# EAGLE design CORDI1-R01 (EAGLE 5.12)
INFO: 7 x 5 x 1.2mm, 12pF; MF: ST; MPN: STPS0540Z; OC_FARNELL: 1838511; REICHELT: SL 1X40G 2,54 (nur 1/2); RS: 250-274
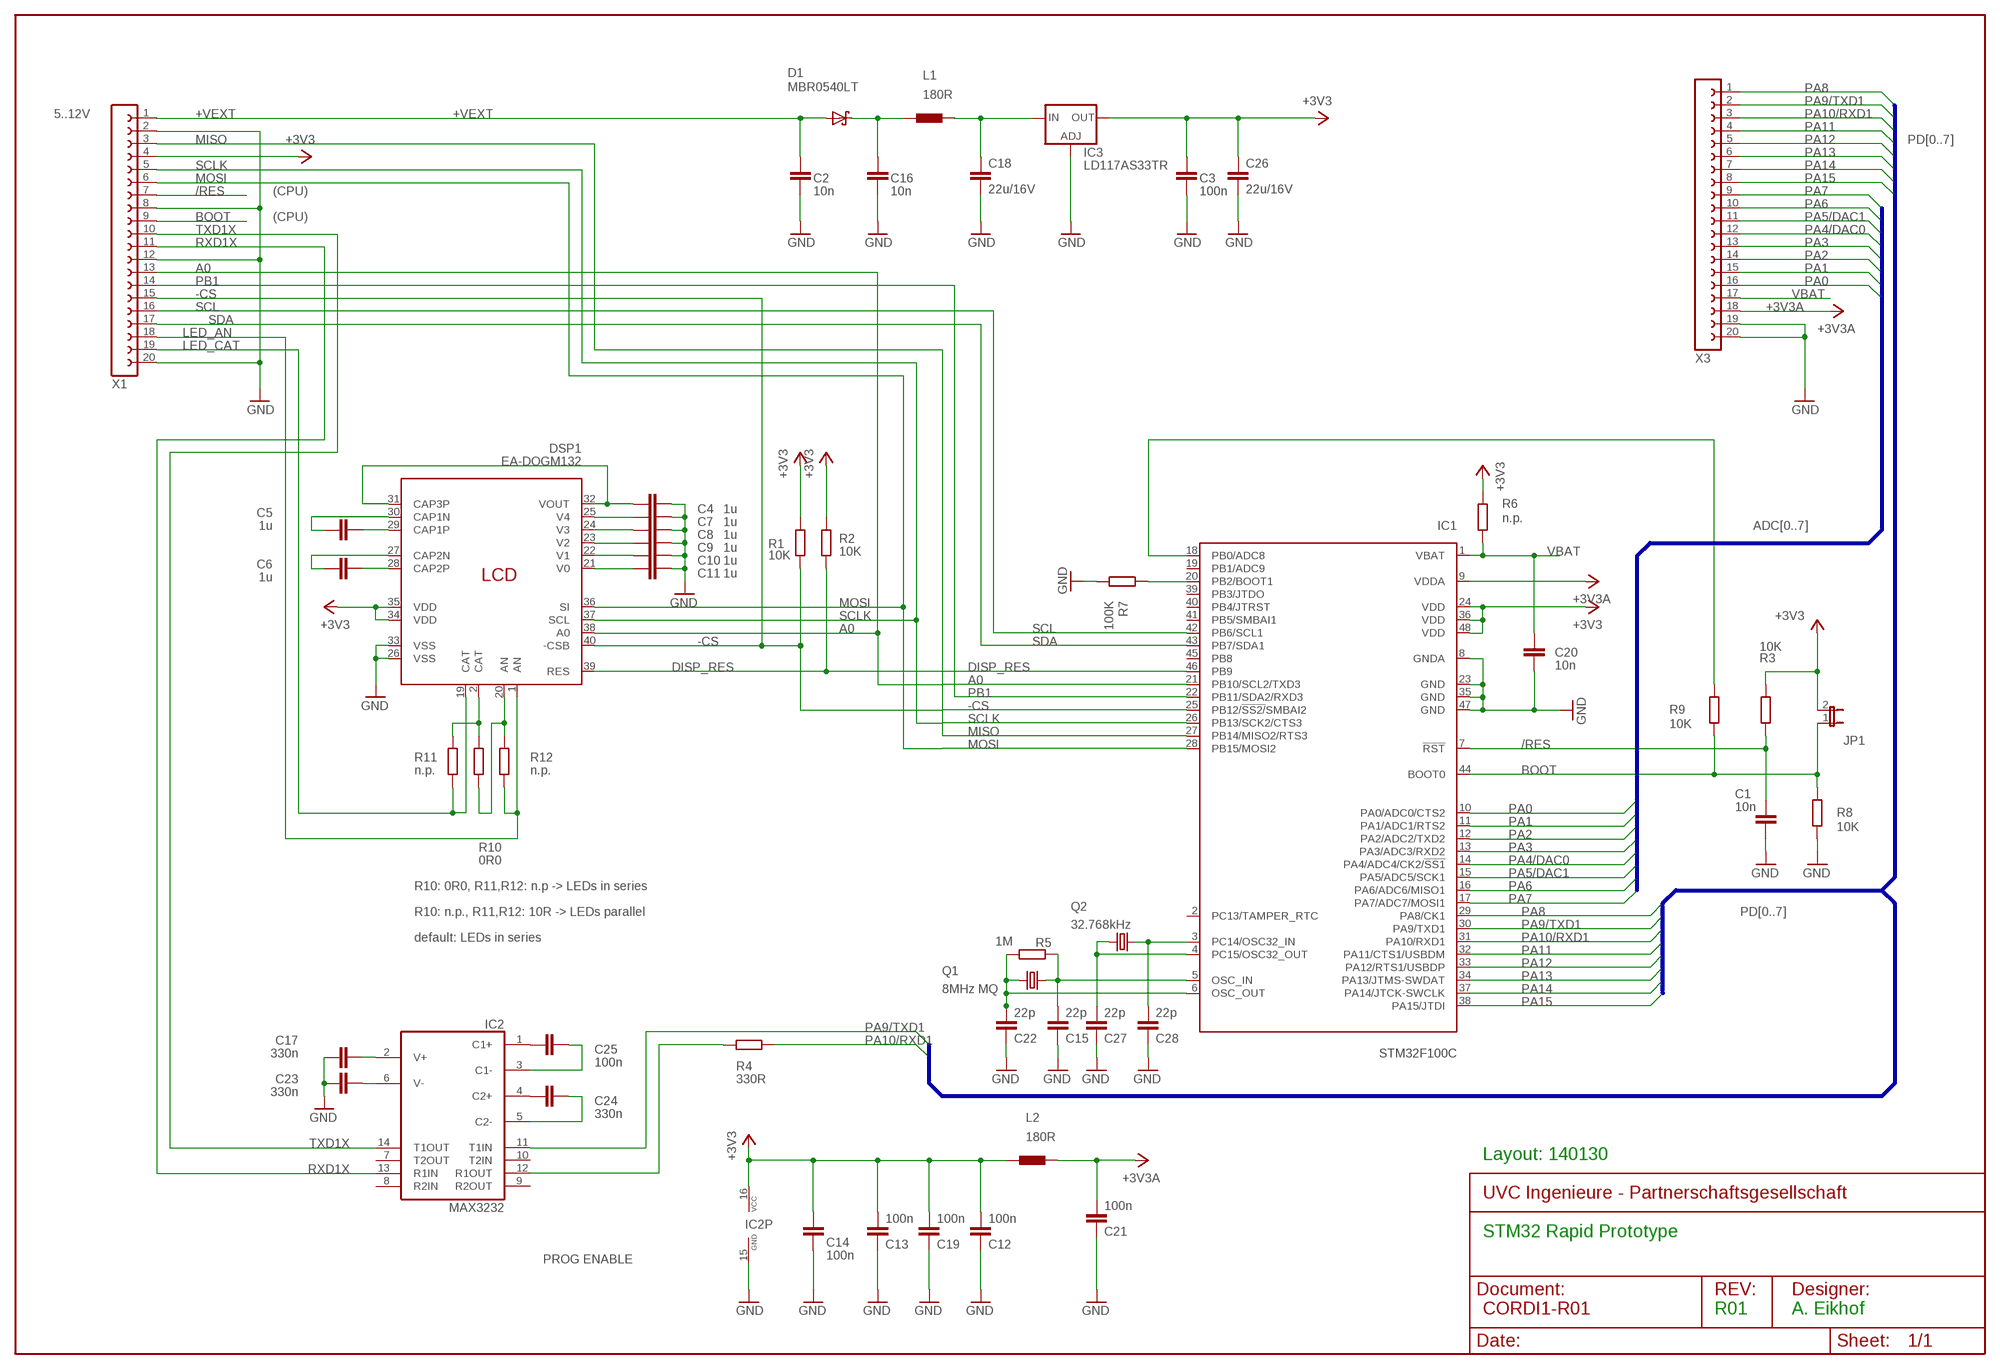
[diagram p0: schematic, sheet 1]

## Parts
C1  10n  C-EUC0603  [C0603]
C2  10n  C-EUC0603  [C0603]
C3  100n  C-EUC0603  [C0603]
C4  1u  C-EUC0603  [C0603]
C5  1u  C-EUC0603  [C0603]
C6  1u  C-EUC0603  [C0603]
C7  1u  C-EUC0603  [C0603]
C8  1u  C-EUC0603  [C0603]
C9  1u  C-EUC0603  [C0603]
C10  1u  C-EUC0603  [C0603]
C11  1u  C-EUC0603  [C0603]
C12  100n  C-EUC0603  [C0603]
C13  100n  C-EUC0603  [C0603]
C14  100n  C-EUC0603  [C0603]
C15  22p  C-EUC0603  [C0603]
C16  10n  C-EUC0603  [C0603]
C17  330n  C-EUC0603  [C0603]
C18  22u/16V  C-EUC1210  [C1210]
C19  100n  C-EUC0603  [C0603]
C20  10n  C-EUC0603  [C0603]
C21  100n  C-EUC0603  [C0603]
C22  22p  C-EUC0603  [C0603]
C23  330n  C-EUC0603  [C0603]
C24  330n  C-EUC0603  [C0603]
C25  100n  C-EUC0603  [C0603]
C26  22u/16V  C-EUC1210  [C1210]
C27  22p  C-EUC0603  [C0603]
C28  22p  C-EUC0603  [C0603]
D1  MBR0540LT  MBR0520LT  [SOD123]
DSP1  EA-DOGM132  DOGM132  [EADOGM08]
IC1  STM32F100C  [TQFP48]
IC2  MAX3232  MAX232CSE  [SO16]
IC3  LD117AS33TR  [SOT223]
JP1  JP1E  [JP1]
L1  180R  WE-CBF_0603  [0603]
L2  180R  WE-CBF_0603  [0603]
Q1  8MHz MQ  MQ  [MQ]
Q2  32.768kHz  FC-135  [FC-135]
R1  10K  R-EU_R0603  [R0603]
R2  10K  R-EU_R0603  [R0603]
R3  10K  R-EU_R0603  [R0603]
R4  330R  R-EU_R0603  [R0603]
R5  1M  R-EU_R0603  [R0603]
R6  n.p.  R-EU_R0603  [R0603]
R7  100K  R-EU_R0603  [R0603]
R8  10K  R-EU_R0603  [R0603]
R9  10K  R-EU_R0603  [R0603]
R10  0R0  R-EU_R0603  [R0603]
R11  n.p.  R-EU_R0603  [R0603]
R12  n.p.  R-EU_R0603  [R0603]
X1  FE20-1  [FE20]
X3  FE20-1  [FE20]

## Nets
+3V3 [SUPPLY3]: C3.1 C12.2 C13.2 C14.1 C19.2 C26.1 DSP1.34(VDD) DSP1.35(VDD) IC1.24(VDD) IC1.36(VDD) IC1.48(VDD) IC2.16(VCC) IC3.4(OUT) JP1.2 L2.1 R1.2 R2.2 R3.2 R6.1 X1.4
+3V3A: C21.2 IC1.9(VDDA) L2.2 X3.18
+VEXT: C2.1 D1.A X1.1
-CS: DSP1.40(-CSB) IC1.25(PB12/!SS2/!SMBAI2) R1.1 X1.15
/RES: C1.2 IC1.7(!RST) R3.1 X1.7
A0: DSP1.38(A0) IC1.21(PB10/SCL2/TXD3) X1.13
BOOT: IC1.44(BOOT0) JP1.1 R8.2 R9.1 X1.9
DISP_RES: DSP1.39(RES) IC1.46(PB9) R2.1
GND: C1.1 C2.2 C3.2 C4.1 C7.1 C8.1 C9.1 C10.1 C11.1 C12.1 C13.1 C14.2 C15.1 C16.2 C17.2 C18.2 C19.1 C20.1 C21.1 C22.1 C23.2 C26.2 C27.1 C28.1 DSP1.26(VSS) DSP1.33(VSS) IC1.8(GNDA) IC1.23(GND) IC1.35(GND) IC1.47(GND) IC2.15(GND) IC3.1(ADJ) R7.1 R8.1 X1.2 X1.8 X1.12 X1.20 X3.19 X3.20
LED_AN: DSP1.1(AN) R12.1 X1.18
LED_AN2: DSP1.20(AN) R10.1 R12.2
LED_CAT: DSP1.19(CAT) R11.1 X1.19
LED_CAT1: DSP1.2(CAT) R10.2 R11.2
MISO: IC1.27(PB14/MISO2/RTS3) X1.3
MOSI: DSP1.36(SI) IC1.28(PB15/MOSI2) X1.6
N$1 [SUPPLY12]: C18.1 IC3.3(IN) L1.2
N$3: IC2.12(R1OUT) R4.2
N$6: C25.2 IC2.1(C1+)
N$7: C17.1 IC2.2(V+)
N$20: C25.1 IC2.3(C1-)
N$28: IC1.18(PB0/ADC8) R9.2
N$30: C16.1 D1.C L1.1
N$31: C4.2 DSP1.31(CAP3P) DSP1.32(VOUT)
N$57: C7.2 DSP1.25(V4)
N$58: C24.1 IC2.5(C2-)
N$62: C24.2 IC2.4(C2+)
N$64: C23.1 IC2.6(V-)
N$67: C8.2 DSP1.24(V3)
N$69: C9.2 DSP1.23(V2)
N$70: C10.2 DSP1.22(V1)
N$71: C11.2 DSP1.21(V0)
N$72: C5.2 DSP1.29(CAP1P)
N$73: C6.2 DSP1.28(CAP2P)
N$74: C6.1 DSP1.27(CAP2N)
N$75: C5.1 DSP1.30(CAP1N)
N$182: C15.2 IC1.5(OSC_IN) Q1.3 R5.2
N$184: C22.2 IC1.6(OSC_OUT) Q1.1 R5.1
N$240: IC1.20(PB2/BOOT1) R7.2
OSC32_IN: C28.2 IC1.3(PC14/OSC32_IN) Q2.2
OSC32_OUT: C27.2 IC1.4(PC15/OSC32_OUT) Q2.1
PA0: IC1.10(PA0/ADC0/CTS2) X3.16
PA1: IC1.11(PA1/ADC1/RTS2) X3.15
PA2: IC1.12(PA2/ADC2/TXD2) X3.14
PA3: IC1.13(PA3/ADC3/RXD2) X3.13
PA4/DAC0: IC1.14(PA4/ADC4/CK2/!SS1) X3.12
PA5/DAC1: IC1.15(PA5/ADC5/SCK1) X3.11
PA6: IC1.16(PA6/ADC6/MISO1) X3.10
PA7: IC1.17(PA7/ADC7/MOSI1) X3.9
PA8: IC1.29(PA8/CK1) X3.1
PA9/TXD1: IC1.30(PA9/TXD1) IC2.11(T1IN) X3.2
PA10/RXD1: IC1.31(PA10/RXD1) R4.1 X3.3
PA11: IC1.32(PA11/CTS1/USBDM) X3.4
PA12: IC1.33(PA12/RTS1/USBDP) X3.5
PA13: IC1.34(PA13/JTMS-SWDAT) X3.6
PA14: IC1.37(PA14/JTCK-SWCLK) X3.7
PA15: IC1.38(PA15/JTDI) X3.8
PB1: IC1.22(PB11/SDA2/RXD3) X1.14
RXD1X: IC2.13(R1IN) X1.11
SCL: IC1.42(PB6/SCL1) X1.16
SCLK: DSP1.37(SCL) IC1.26(PB13/SCK2/CTS3) X1.5
SDA: IC1.43(PB7/SDA1) X1.17
TXD1X: IC2.14(T1OUT) X1.10
VBAT: C20.2 IC1.1(VBAT) R6.2 X3.17
Unconnected: IC1.2(PC13/TAMPER_RTC) IC1.19(PB1/ADC9) IC1.39(PB3/JTDO) IC1.40(PB4/JTRST) IC1.41(PB5/SMBAI1) IC1.45(PB8) IC2.7(T2OUT) IC2.8(R2IN) IC2.9(R2OUT) IC2.10(T2IN)

## Buses
PD[0..7]
ADC[0..7]

## Notes on the sheet
- 5..12V
- (CPU)
- (CPU)
- R10: 0R0, R11,R12: n.p -> LEDs in series
- R10: n.p., R11,R12: 10R -> LEDs parallel
- default: LEDs in series
- Layout: 140130
- STM32 Rapid Prototype
- PROG ENABLE
- R01 | A. Eikhof

## Power pins joined to a net without a drawn wire
GND: Q1.2(GND) Q1.4(GND)

## Library data of the parts
C1-C28 = _rcl:C-EU: CAPACITOR, European symbol
D1 = _diode:MBR0520LT: SCHOTTKY BARRIER RECTIFIER Source: http://onsemi.com .. MBR0520LT1-D.pdf
DSP1 = LCDISPLA:DOGM132
IC1 = _stm32:STM32F100C
IC2 = _maxim:MAX232: RS232 TRANSEIVER
IC3 = v-reg:LD117A?*: Low drop fixed and adjustable positive voltage regulators 1 A Source: http://www.st.com/stonline/products/literature/ds/7194/ld1117axx.pdf
JP1 = _jumper:JP1E: JUMPER
L1 L2 = _wuerth-elektronik:WE-CBF: SMD EMI Suppression Ferrite Beads - excellent anti-EMI properties - low DCR - impedances till 3000 ohms - rated current up to 6 A
Q1 = _crystal:MQ: MQ ( 7.0 * 5.0 * 1.2 mm ) Series, Euroquartz, Mercury
Q2 = _crystal:FC-135: Epson Toyocom, kHz Range crystal unit, low profile smd 1.5 x 3.2mm
R1-R12 = _rcl:R-EU_: RESISTOR, European symbol
X1 X3 = _con-lsta:FE20-1: FEMALE HEADER

## Net classes
1 PWR: width 0.254 mm, drill 0.5 mm, clearance 0.152 mm
2 SUPPLY3: width 0.254 mm, drill 0.406 mm
3 SUPPLY12: width 0.61 mm

## Board
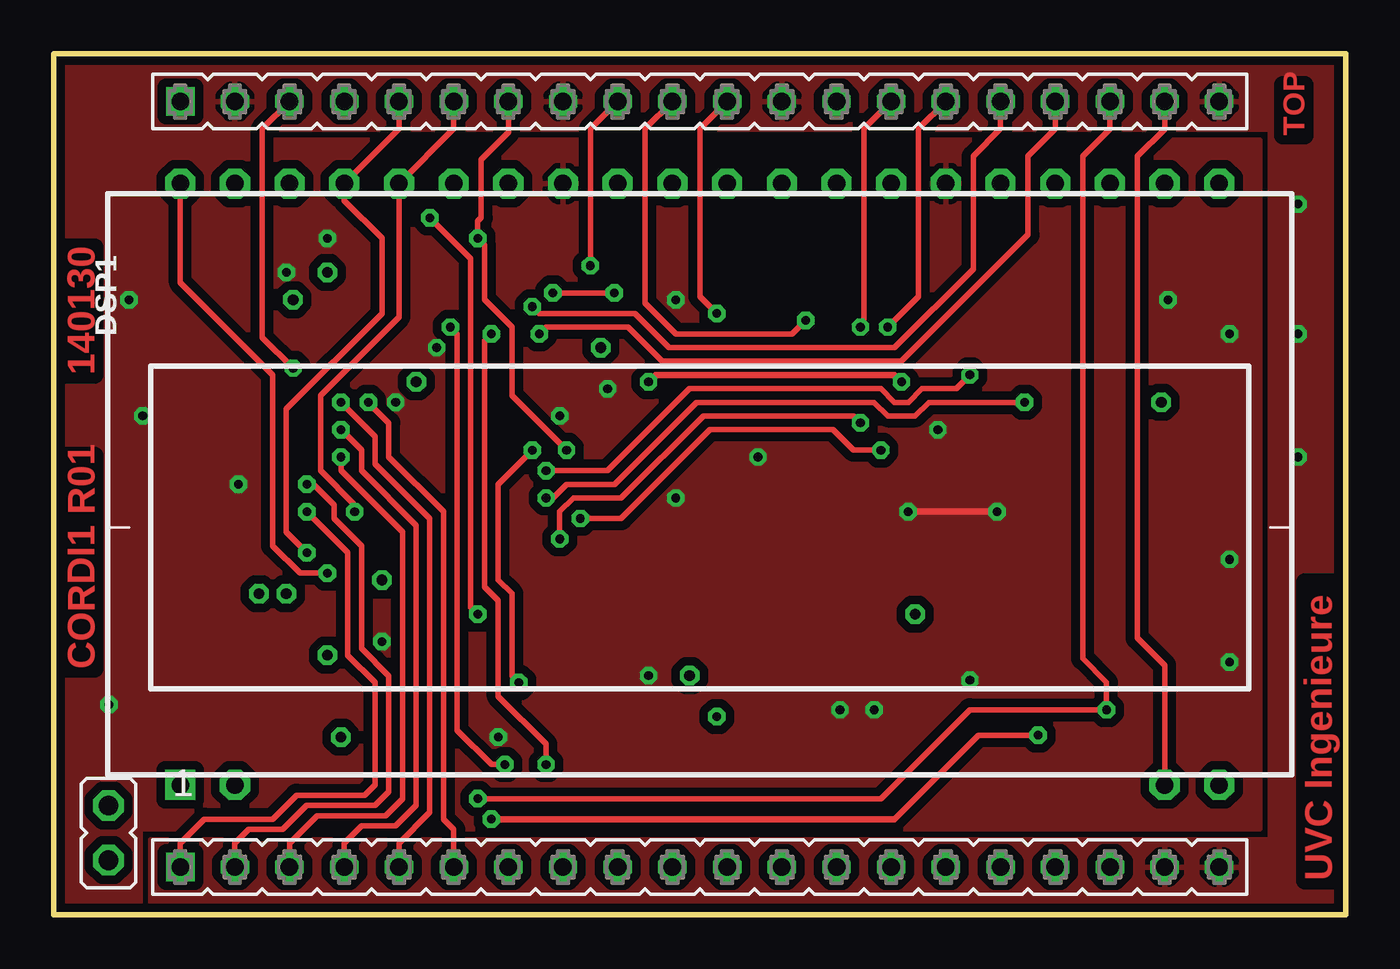
[diagram p1: board, top side]
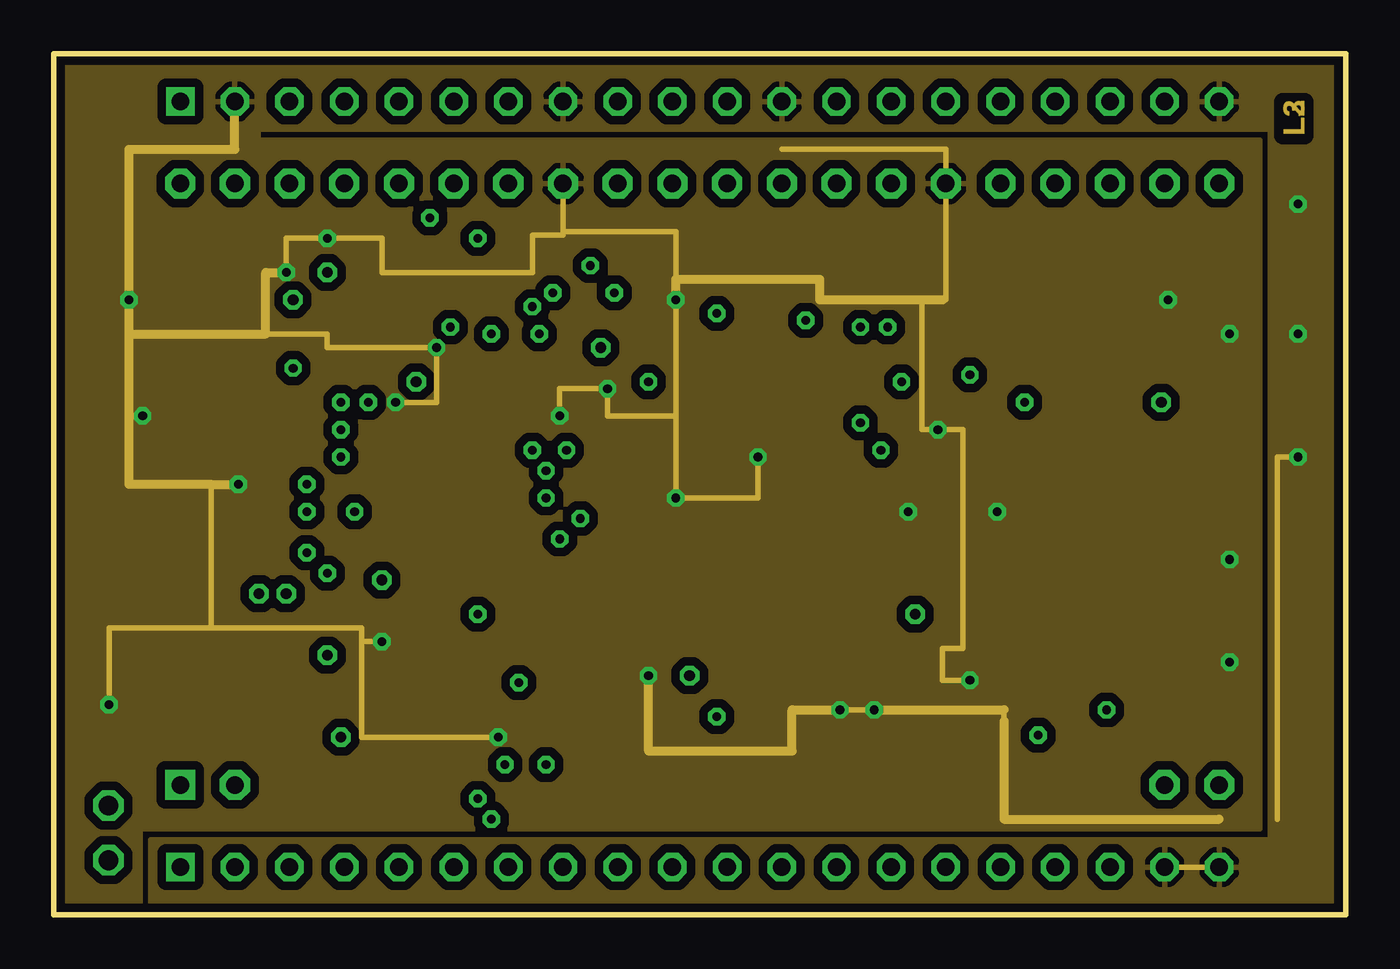
[diagram p2: board, inner layer Route2]
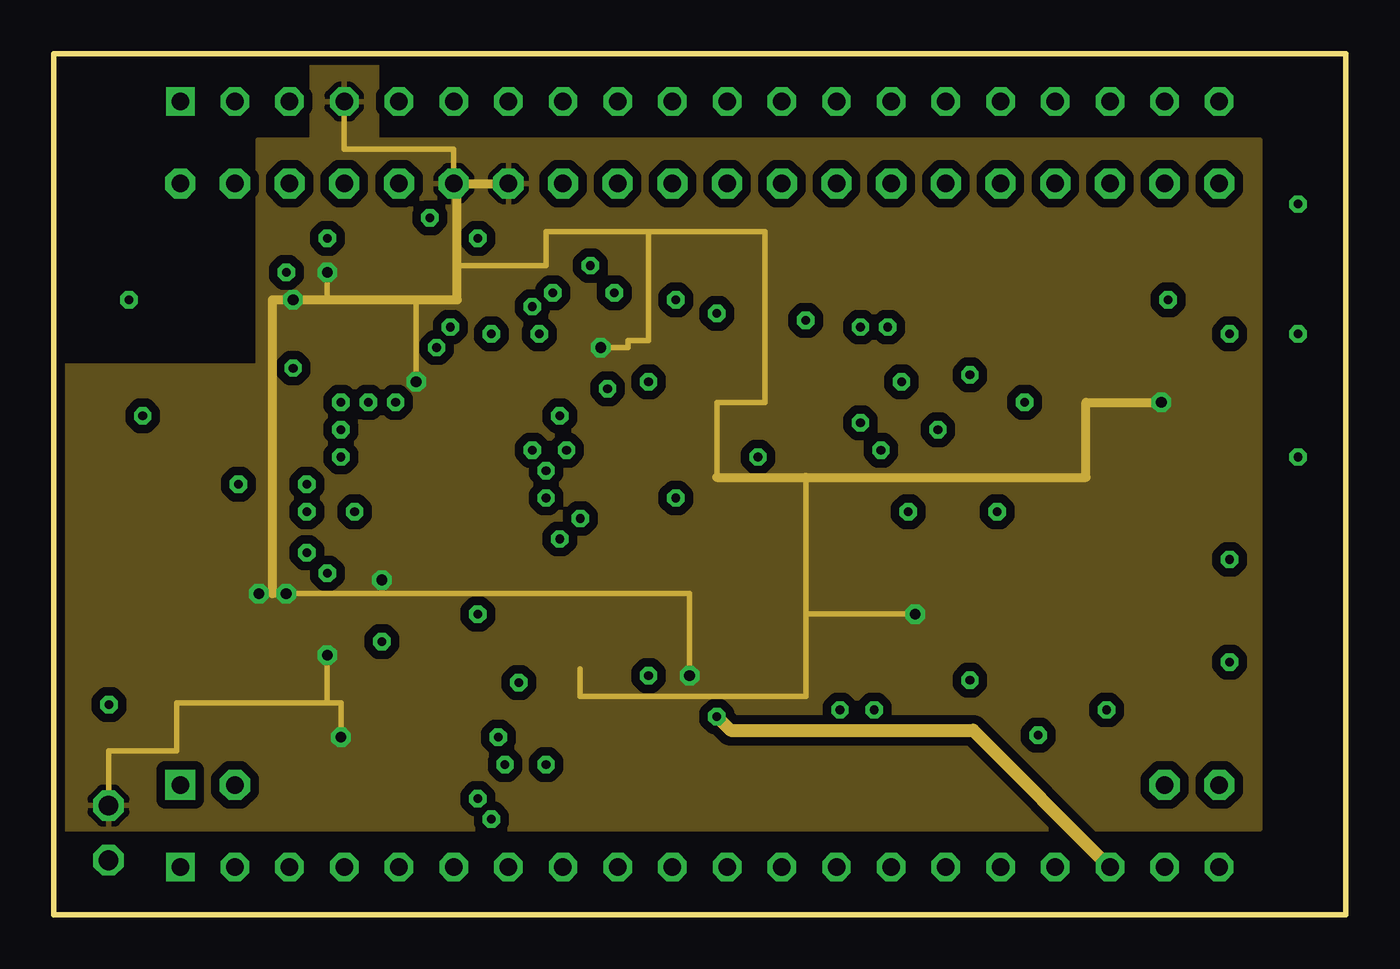
[diagram p3: board, inner layer Route3]
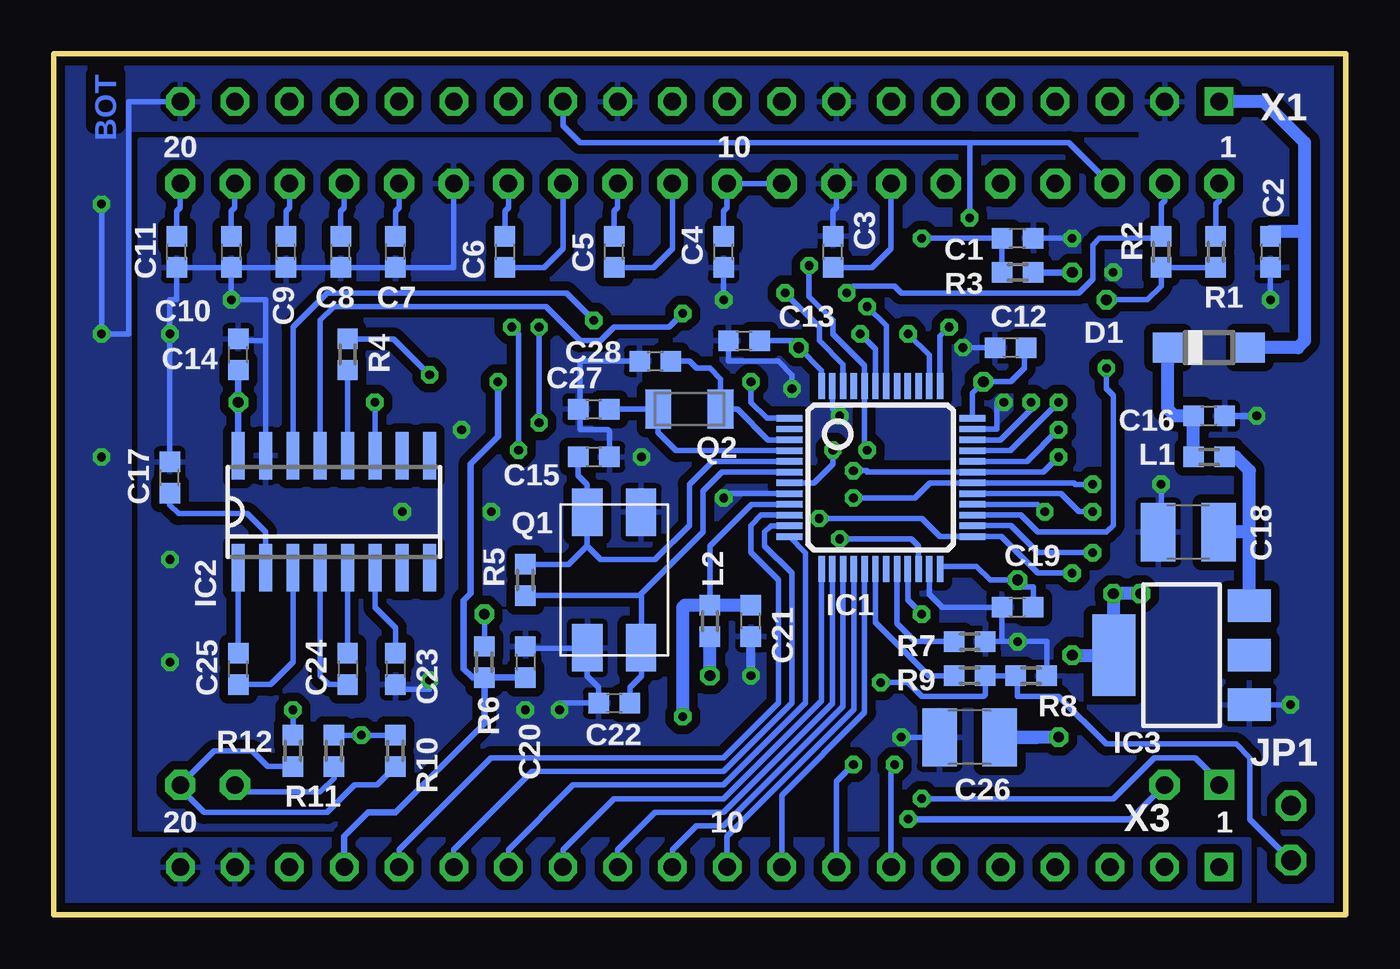
[diagram p4: board, bottom side, seen from below]

Size 60 x 40 mm. Coordinates in mm from the lower left corner, seen from the top.
Outline: 0,0 60,0 60,40 0,40 0,0
Copper layers (1*2*3*16): Top 0.035mm / dielectric 0.36mm / Route2 0.035mm / dielectric 0.71mm / Route3 0.035mm / dielectric 0.36mm / Bottom 0.035mm
Design rules "default *": minimum track width 7mil, minimum drill 15mil, track to track 6mil, track to pad 6mil, pad to pad 6mil, via to via 6mil, smd to smd 6mil, copper to edge 16mil, drill to drill 8mil, minimum pad ring 10mil, minimum via ring 8mil, stop-mask expansion 4mil, vias tented up to drill 24mil, thermal gap 10mil

### Footprints (pad centres in the part's own frame; a part is rotated, then mirrored left to right if it is on the bottom)
C0603 = smd 0.95 x 0.95: 1 -0.725,0; 2 0.725,0
C1210 = smd 1.6 x 2.7: 1 -1.4,0; 2 1.4,0
SOD123 = smd 1.4 x 1.4: A 1.9,0; C -1.9,0
EADOGM08 = drill 0.813 pad 1.397 square: 1 -24.13,-13.97 | drill 0.813 pad 1.397 octagon: 2 -21.59,-13.97; 19 21.59,-13.97; 20 24.13,-13.97; 21 24.13,13.97; 22 21.59,13.97; 23 19.05,13.97; 24 16.51,13.97; 25 13.97,13.97; 26 11.43,13.97; 27 8.89,13.97; 28 6.35,13.97; 29 3.81,13.97; 30 1.27,13.97; 31 -1.27,13.97; 32 -3.81,13.97; 33 -6.35,13.97; 34 -8.89,13.97; 35 -11.43,13.97; 36 -13.97,13.97; 37 -16.51,13.97; 38 -19.05,13.97; 39 -21.59,13.97; 40 -24.13,13.97
TQFP48 = smd 0.3 x 1.2: 1 -2.75,-4.25; 2 -2.25,-4.25; 3 -1.75,-4.25; 4 -1.25,-4.25; 5 -0.75,-4.25; 6 -0.25,-4.25; 7 0.25,-4.25; 8 0.75,-4.25; 9 1.25,-4.25; 10 1.75,-4.25; 11 2.25,-4.25; 12 2.75,-4.25; 25 2.75,4.25; 26 2.25,4.25; 27 1.75,4.25; 28 1.25,4.25; 29 0.75,4.25; 30 0.25,4.25; 31 -0.25,4.25; 32 -0.75,4.25; 33 -1.25,4.25; 34 -1.75,4.25; 35 -2.25,4.25; 36 -2.75,4.25 | smd 1.2 x 0.3: 13 4.25,-2.75; 14 4.25,-2.25; 15 4.25,-1.75; 16 4.25,-1.25; 17 4.25,-0.75; 18 4.25,-0.25; 19 4.25,0.25; 20 4.25,0.75; 21 4.25,1.25; 22 4.25,1.75; 23 4.25,2.25; 24 4.25,2.75; 37 -4.25,2.75; 38 -4.25,2.25; 39 -4.25,1.75; 40 -4.25,1.25; 41 -4.25,0.75; 42 -4.25,0.25; 43 -4.25,-0.25; 44 -4.25,-0.75; 45 -4.25,-1.25; 46 -4.25,-1.75; 47 -4.25,-2.25; 48 -4.25,-2.75
SO16 = smd 0.6 x 2.2: 1 -4.445,-2.6; 2 -3.175,-2.6; 3 -1.905,-2.6; 4 -0.635,-2.6; 5 0.635,-2.6; 6 1.905,-2.6; 7 3.175,-2.6; 8 4.445,-2.6; 9 4.445,2.6; 10 3.175,2.6; 11 1.905,2.6; 12 0.635,2.6; 13 -0.635,2.6; 14 -1.905,2.6; 15 -3.175,2.6; 16 -4.445,2.6
SOT223 = smd 1.5 x 2: 1 -2.3,-3.15; 2 0,-3.15; 3 2.3,-3.15 | smd 3.8 x 2: 4 0,3.15
JP1 = drill 0.914 octagon: 1 0,-1.27; 2 0,1.27
0603 = smd 0.95 x 0.95: 1 -0.725,0; 2 0.725,0
MQ = smd 2.2 x 1.4: 1 -3.15,-1.25; 2 3.15,-1.25; 3 3.15,1.25; 4 -3.15,1.25
FC-135 = smd 1.2 x 1.8: 1 -1.45,0; 2 1.45,0
R0603 = smd 0.95 x 0.95: 1 -0.725,0; 2 0.725,0
FE20 = drill 0.813 square: 1 -24.13,0 | drill 0.813 octagon: 2 -21.59,0; 3 -19.05,0; 4 -16.51,0; 5 -13.97,0; 6 -11.43,0; 7 -8.89,0; 8 -6.35,0; 9 -3.81,0; 10 -1.27,0; 11 1.27,0; 12 3.81,0; 13 6.35,0; 14 8.89,0; 15 11.43,0; 16 13.97,0; 17 16.51,0; 18 19.05,0; 19 21.59,0; 20 24.13,0

### Placement (x,y rotation side)
C1  15.24,31.43 180 bottom
C2  3.49,30.8 270 bottom
C3  23.81,30.8 90 bottom
C4  28.89,30.8 90 bottom
C5  33.97,30.8 90 bottom
C6  39.05,30.8 270 bottom
C7  44.13,30.8 90 bottom
C8  46.67,30.8 90 bottom
C9  49.21,30.8 90 bottom
C10  51.75,30.8 90 bottom
C11  54.29,30.8 90 bottom
C12  15.56,26.35 0 bottom
C13  27.94,26.67 0 bottom
C14  51.44,26.04 90 bottom
C15  34.92,21.27 180 bottom
C16  6.35,23.18 0 bottom
C17  54.61,20.32 90 bottom
C18  7.3,17.78 180 bottom
C19  15.24,14.29 0 bottom
C20  38.1,11.75 270 bottom
C21  27.62,13.65 90 bottom
C22  33.97,9.84 0 bottom
C23  44.13,11.43 270 bottom
C24  46.35,11.43 270 bottom
C25  51.44,11.43 90 bottom
C26  17.46,8.26 180 bottom
C27  34.92,23.5 0 bottom
C28  32.07,25.72 0 bottom
D1  6.35,26.35 0 bottom
DSP1  30,20 0 top
IC1  21.59,20.32 270 bottom
IC2  46.99,18.73 0 bottom
IC3  7.62,12.06 90 bottom
JP1  2.54,3.81 0 top
L1  6.35,21.27 0 bottom
L2  29.53,13.65 90 bottom
Q1  33.97,15.56 90 bottom
Q2  30.48,23.5 0 bottom
R1  6.03,30.8 270 bottom
R2  8.57,30.8 270 bottom
R3  15.24,29.84 0 bottom
R4  46.35,26.04 270 bottom
R5  38.1,15.56 90 bottom
R6  40.01,11.75 270 bottom
R7  17.46,12.7 180 bottom
R8  14.61,11.11 180 bottom
R9  17.46,11.11 180 bottom
R10  44.13,7.62 90 bottom
R11  46.99,7.62 90 bottom
R12  48.9,7.62 270 bottom
X1  30,37.78 0 top
X3  30,2.22 0 top

### Tracks (layer width: path | path; a pad name or v marks a point on that pad's centre or on a via)
+3V3  (via drill 0.5)
  Route3 0.254: X1.4 13.49,35.56 18.57,35.56 DSP1.35 | 18.73,30.16 22.86,30.16 22.86,31.75 27.62,31.75 | 27.62,31.75 33.02,31.75 33.02,23.81 30.8,23.81 30.8,20.32 | 24.45,11.43 24.45,10.16 34.92,10.16 34.92,13.97 | 34.92,20.32 34.92,13.97 | v29.53,11.11 29.53,14.92 15.24,14.92 | 27.62,31.75 27.62,26.67 26.67,26.67 26.67,26.35 v25.4,26.35 | 11.11,14.92 15.24,14.92 | 15.24,14.92 v15.24,15.56 | 34.92,13.97 v40.01,13.97 | 16.83,28.57 v16.83,24.77 | JP1.2 2.54,7.62 5.71,7.62 5.71,9.84 12.7,9.84 | 12.7,9.84 13.34,9.84 v13.34,8.26 | 12.7,9.84 v12.7,12.06 | 12.7,28.57 v12.7,29.84
  Route3 0.406: 18.73,33.97 DSP1.34 | 30.8,20.32 34.92,20.32 47.94,20.32 47.94,23.81 v51.44,23.81 | 18.73,33.97 18.73,30.16 18.73,28.57 16.83,28.57 12.7,28.57 v11.11,28.57 10.16,28.57 10.16,14.92 v10.79,14.92 11.11,14.92 | 18.73,33.97 DSP1.35
  Bottom 0.254: R1.2 R2.2 8.57,29.21 9.21,28.57 v11.11,28.57 | C13.2 25.72,26.67 v25.4,26.35 24.34,25.29 IC1.48 | IC1.24 18.84,16.19 17.14,16.19 16.51,15.56 v15.24,15.56 15.24,15.24 14.52,15.24 C19.2 | v40.01,13.97 R6.1 | IC1.36 17.34,24.25 v16.83,24.77 15.56,24.77 14.92,25.4 14.92,26.35 C12.2 | C3.1 22,30.07 21.11,30.96 DSP1.34
  Bottom 0.305: IC2.16 v51.44,23.81 C14.1 | v12.7,29.84 R3.2
  Bottom 0.61: 10.79,12.38 v10.79,14.92 v9.53,14.92 | v13.34,8.26 C26.1 14.29,8.26 | v29.53,11.11 L2.1 | v12.7,12.06 IC3.4
  pour Route3 (isolate 0.406): 0.5,4 0.5,25.5 9.5,25.5 9.5,36 12,36 12,39.5 15,39.5 15,36 56,36 56,4
+3V3A  (via drill 0.4)
  Route3 0.61: X3.18 42.7,8.57 31.43,8.57 v30.8,9.21
  Bottom 0.254: IC1.9 27.6,19.07 29.53,17.14 L2.2
  Bottom 0.406: 30.71,14.38 30.8,14.29
  Bottom 0.61: C21.2 L2.2 30.71,14.38 | 30.8,14.29 v30.8,9.21
+VEXT
  Bottom 0.254: 3.49,31.75 C2.1
  Bottom 0.61: X1.1 3.81,37.78 1.91,35.88 1.91,31.75 | 1.91,31.75 3.49,31.75 | 1.91,31.75 1.91,26.67 2.22,26.35 D1.A
-CS  (via drill 0.4)
  Top 0.254: v24.45,18.41 26.35,18.41 30.48,22.54 36.2,22.54 37.15,21.59 v38.42,21.59 | X1.15 40.16,36.52 40.16,28.73 v38.73,27.3 | v12.7,15.88 11.43,15.88 10.16,17.14 10.16,25.08 5.87,29.37 DSP1.40
  Bottom 0.254: DSP1.40 5.87,33.18 6.03,33.02 R1.1 | v24.45,18.41 19.68,18.41 18.84,17.57 IC1.25 15.98,17.57 14.29,15.88 v12.7,15.88 | v38.42,21.59 38.42,26.99 v38.73,27.3
/RES  (via drill 0.4)
  Top 0.254: X1.7 21.11,36.35 19.84,35.08 19.84,32.38 19.68,32.23 v19.68,31.43 20,31.11 20,28.57 21.27,27.3 21.27,24.13 v23.81,21.59
  Bottom 0.254: IC1.7 24.7,20.07 23.81,20.95 v23.81,21.59 | v19.68,31.43 C1.2 R3.1
A0  (via drill 0.4)
  Top 0.254: v19.68,13.97 19.37,14.29 19.37,30.48 v17.46,32.38
  Bottom 0.254: 17.46,35.88 12.86,35.88 DSP1.38 | 17.46,35.88 35.56,35.88 36.35,36.67 X1.13 | IC1.21 20.34,14.62 v19.68,13.97 | v17.46,32.38 17.46,35.88
BOOT  (via drill 0.4)
  Top 0.254: v24.92,30.16 24.92,36.52 X1.9 | v22.23,21.59 20.64,20 20.64,15.56 21.27,14.92 21.27,11.11 v21.59,10.79
  Bottom 0.254: v24.92,30.16 24.92,28.73 23.81,27.62 23.81,26.99 22.34,25.52 IC1.44 22.34,21.7 v22.23,21.59 | v21.59,10.79 20.32,10.79 19.68,10.16 16.83,10.16 16.74,10.25 R9.1 R8.2 15.24,11.02 15.24,10.16 13.34,10.16 11.11,7.94 5.08,7.94 4.45,7.3 4.45,4.45 JP1.1
DISP_RES  (via drill 0.4)
  Top 0.254: v23.18,28.89 v26.04,28.89
  Bottom 0.254: DSP1.39 8.41,33.18 8.57,33.02 R2.1 8.66,31.43 11.43,31.43 11.75,31.11 11.75,29.53 12.38,28.89 20.64,28.89 20.95,29.21 22.86,29.21 v23.18,28.89 | IC1.46 23.34,25.56 24.45,26.67 24.45,27.3 v26.04,28.89
GND  (via drill 0.4)
  Top 0.305: v39.69,18.73 v43.81,18.73
  Route2 0.254: 33.81,35.56 41.43,35.56 DSP1.26 41.43,28.57 41.27,28.57 40.32,28.57 40.32,22.54 v41.06,22.54 42.23,22.54 42.23,12.38 41.27,12.38 41.27,10.9 v42.55,10.9 | 14.29,12.7 14.29,8.26 v20.64,8.26 | 14.29,12.7 14.29,13.34 7.3,13.34 | 7.3,13.34 7.3,20 | v10.79,29.84 10.79,31.43 v12.7,31.43 15.24,31.43 15.24,29.84 22.23,29.84 22.23,31.59 23.65,31.59 23.65,31.75 | 23.65,31.75 DSP1.33 | 23.65,31.75 28.89,31.75 v28.89,28.57 28.89,23.18 | 36.2,9.53 v36.51,9.53 v38.1,9.53 | 44.13,9.53 44.13,8.99 | 28.89,23.18 v28.89,19.37 32.7,19.37 v32.7,21.27 | v23.5,23.18 23.5,24.45 v25.72,24.45 25.72,23.18 28.89,23.18 | 14.29,12.7 v15.24,12.7 | v15.88,23.81 17.78,23.81 v17.78,26.35 12.7,26.35 12.7,26.99 9.84,26.99 | X3.19 X3.20 | 56.83,4.45 56.83,21.27 v57.78,21.27 | 7.3,13.34 2.56,13.34 v2.56,9.77
  Route2 0.305: 3.49,23.18 v4.13,23.18
  Route2 0.406: v38.1,9.53 44.13,9.53 | 54.13,4.45 44.13,4.45 44.13,8.99 | X1.2 8.41,35.56 3.49,35.56 v3.49,28.57 3.49,26.99 | 3.49,26.99 3.49,23.18 3.49,20 7.3,20 v8.57,20 | v10.79,29.84 9.84,29.84 9.84,26.99 3.49,26.99 | v28.89,28.57 28.89,29.53 35.56,29.53 35.56,28.57 41.27,28.57 | 36.2,9.53 34.29,9.53 34.29,7.62 27.62,7.62 v27.62,11.11
  Bottom 0.254: C10.1 C9.1 C8.1 C7.1 41.43,30.07 DSP1.26 | C10.1 C11.1 54.29,28.57 54.61,28.57 C17.2 | 50.16,26.67 51.44,26.67 C14.2 | C10.1 v51.75,28.57 50.16,28.57 50.16,26.67 | 50.16,26.67 IC2.15 | DSP1.33 23.65,32.87 23.81,32.7 C3.2 | v3.49,28.57 C2.2 | X1.20 56.52,37.78 56.52,26.99 v57.78,26.99 v57.78,33.02 | v28.89,28.57 C4.1 | C23.2 44.13,10.48 42.55,10.48 v42.55,10.9 | v20.64,8.26 C26.2 | IC3.1 v2.56,9.77 | Q1.2 32.7,18.73 | 35.24,12.39 35.24,11.11 34.7,10.57 C22.1 36.51,9.84 v36.51,9.53 | 35.24,12.39 Q1.4 | IC1.47 23.84,23.52 v23.5,23.18 | IC1.23 19.34,14.89 18.73,14.29 C19.1 15.96,12.7 | 15.96,12.7 v15.24,12.7 13.88,12.7 R8.1 | 15.96,12.7 R7.1 | v25.72,24.45 25.72,25.08 26.35,25.72 28.66,25.72 C13.1 | 35.24,12.39 38.1,12.39 C20.1 | v17.78,26.35 C12.1 | v15.88,23.81 16.19,23.81 16.19,22.57 IC1.35 | v12.7,31.43 C1.1 | C18.2 8.57,17.78 v8.57,20 | IC1.8 28.89,19.57 v28.89,19.37 | C28.1 35.56,25.72 35.56,23.59 C27.1 35.56,23.41 35.56,22.54 34.29,22.54 34.2,22.45 C15.1
  Bottom 0.305: v4.13,23.18 C16.2
  Bottom 0.406: v27.62,11.11 C21.1
  other vias: 54.61,26.99 54.61,16.51 54.61,11.75
  pour Bottom (isolate 0.406): 0.5,0.5 0.5,39.5 59.5,39.5 59.5,0.5 4.5,0.5 4.5,3.5 56.5,3.5 56.5,36.5 9.5,36.5 9.5,36 56,36 56,4 4,4 4,0.5
  pour Top (isolate 0.406): 0.5,0.5 0.5,39.5 59.5,39.5 59.5,0.5 4.5,0.5 4.5,3.5 56.5,3.5 56.5,36.5 9.5,36.5 9.5,36 56,36 56,4 4,4 4,0.5
  pour Route2 (isolate 0.406): 0.5,0.5 0.5,39.5 59.5,39.5 59.5,0.5 4.5,0.5 4.5,3.5 56.5,3.5 56.5,36.5 9.5,36.5 9.5,36 56,36 56,4 4,4 4,0.5
LED_AN  (via drill 0.4)
  Top 0.254: X1.18 49.05,36.51 47.78,35.24 47.78,11.91 48.9,10.79 v48.9,9.53 42.55,9.53 38.42,5.4 v19.68,5.4
  Bottom 0.254: v48.9,9.53 R12.1 | v19.68,5.4 10.79,5.4 8.89,7.3 6.99,7.3 5.87,6.19 DSP1.1
LED_AN2
  Bottom 0.254: R12.2 50.08,6.89 50.8,7.62 52.54,7.62 DSP1.20 54.13,5.87 53.02,4.76 47.31,4.76 46.04,6.03 44.99,6.03 R10.1
LED_CAT
  Top 0.254: X1.19 51.59,36.51 50.32,35.24 50.32,12.86 51.59,11.59 DSP1.19
  Bottom 0.254: DSP1.19 51.27,5.71 47.62,5.71 46.99,6.35 R11.1
LED_CAT1  (via drill 0.4)
  Top 0.254: 42.55,7.94 42.95,8.35 v45.72,8.35
  Top 0.305: v20.32,4.45 39.05,4.45 42.55,7.94
  Bottom 0.254: R10.2 v45.72,8.35 R11.2
  Bottom 0.305: DSP1.2 10,4.45 v20.32,4.45
MISO  (via drill 0.4)
  Top 0.254: v11.11,25.4 9.68,26.83 9.68,36.52 X1.3
  Bottom 0.254: v11.11,25.4 11.11,24.45 10.79,24.13 10.79,18.1 11.11,17.78 14.29,17.78 15.08,18.57 IC1.27
MOSI  (via drill 0.4)
  Top 0.254: v13.97,18.73 13.97,19.05 12.38,20.64 12.38,24.13 16.03,27.78 DSP1.36 18.57,36.51 X1.6
  Bottom 0.254: IC1.28 14.31,19.07 v13.97,18.73
N$1
  Bottom 0.61: 4.47,17.78 C18.1 | IC3.3 4.47,17.78 | 4.47,17.78 4.47,20.64 5.11,21.27 L1.2
N$3
  Bottom 0.254: IC2.12 R4.2
N$6
  Bottom 0.254: C25.2 IC2.1
N$7
  Bottom 0.254: IC2.2 50.16,17.78 51.03,18.64 54.2,18.64 54.61,19.05 C17.1
N$20
  Bottom 0.254: C25.1 49.94,10.71 48.9,11.75 IC2.3
N$28
  Bottom 0.254: IC1.18 21.84,13.59 19.37,11.11 R9.2
N$30
  Bottom 0.61: L1.1 C16.1 7.94,23.18 8.25,23.49 D1.C
N$31
  Bottom 0.254: C4.2 28.89,32.7 28.73,32.87 DSP1.31 DSP1.32
N$57
  Bottom 0.254: DSP1.25 43.97,32.87 44.13,32.7 C7.2
N$58
  Bottom 0.254: C24.1 IC2.5
N$62
  Bottom 0.254: C24.2 47.22,10.71 47.62,11.11 IC2.4
N$64
  Bottom 0.254: IC2.6 45.09,14.29 44.13,13.34 C23.1
N$67
  Bottom 0.254: DSP1.24 46.51,32.87 46.67,32.7 C8.2
N$69
  Bottom 0.254: DSP1.23 49.05,32.87 49.21,32.7 C9.2
N$70
  Bottom 0.254: DSP1.22 51.59,32.87 51.75,32.7 C10.2
N$71
  Bottom 0.254: DSP1.21 54.13,32.87 54.29,32.7 C11.2
N$72
  Bottom 0.254: DSP1.29 33.81,32.87 33.97,32.7 C5.2
N$73
  Bottom 0.254: 36.51,30.8 36.35,30.96 36.35,31.02 DSP1.28 | 36.51,30.8 | 36.51,30.8 37.24,30.07 C6.2
N$74
  Bottom 0.254: DSP1.27 38.89,32.87 39.05,32.7 C6.1
N$75
  Bottom 0.254: 31.43,30.8 31.27,30.96 31.27,31.02 DSP1.30 | 31.43,30.8 | 31.43,30.8 32.16,30.07 C5.1
N$182
  Bottom 0.254: IC1.5 29.41,21.07 30.48,20 30.48,18.1 32.07,16.51 34.61,16.51 35.24,17.14 | 35.24,17.14 35.24,18.69 Q1.3 35.24,18.73 35.24,20 35.65,20.41 C15.2 | 35.24,17.14 36.1,16.28 R5.2
N$184
  Bottom 0.254: 32.7,14.92 29.84,17.78 29.84,19.68 28.96,20.57 IC1.6 | 32.7,14.92 32.7,12.43 Q1.1 32.7,12.39 32.7,11.11 33.25,10.57 C22.2 | 32.7,14.92 32.79,14.83 R5.1
N$240
  Bottom 0.254: IC1.20 20.84,13.54 20.64,13.34 20,12.7 R7.2
OSC32_IN
  Bottom 0.254: IC1.3 26.83,22.07 28.26,23.5 Q2.2 29.03,24.9 29.53,25.4 30.16,25.4 30.48,25.72 C28.2
OSC32_OUT
  Bottom 0.254: C27.2 Q2.1 31.93,22.41 31.09,21.57 IC1.4
PA0
  Bottom 0.254: X3.16 43.97,3.02 40.32,6.67 39.69,7.3 38.1,7.3 28.89,7.3 26.35,9.84 26.35,15.56 27.62,16.83 27.62,18.1 27.15,18.57 IC1.10
PA1
  Bottom 0.254: X3.15 41.43,3.02 37.78,6.67 36.2,6.67 28.89,6.67 25.72,9.84 25.72,15.88 26.99,17.14 26.99,17.78 26.7,18.07 IC1.11
PA2
  Bottom 0.254: IC1.12 25.08,16.81 25.08,9.84 28.89,6.03 35.56,6.03 35.88,6.03 38.89,3.02 X3.14
PA3
  Bottom 0.254: IC1.13 24.34,9.95 28.89,5.4 33.66,5.4 33.97,5.4 36.35,3.02 X3.13
PA4/DAC0
  Bottom 0.254: IC1.14 23.84,9.81 28.89,4.76 32.07,4.76 33.81,3.02 X3.12
PA5/DAC1
  Bottom 0.254: IC1.15 23.34,9.68 28.89,4.13 30.16,4.13 31.27,3.02 X3.11
PA6
  Bottom 0.254: IC1.16 22.84,9.54 28.73,3.65 X3.10
PA7
  Bottom 0.254: IC1.17 22.34,9.41 26.19,5.56 X3.9
PA8  (via drill 0.4)
  Top 0.254: X3.1 5.87,3.33 6.99,4.45 10.16,4.45 11.27,5.56 14.45,5.56 14.92,6.03 14.92,10.79 13.65,12.06 13.65,16.83 v11.75,18.73
  Bottom 0.254: v11.75,18.73 12.38,18.73 13.22,19.57 IC1.29
PA9/TXD1  (via drill 0.4)
  Top 0.254: X3.2 8.41,3.33 9.05,3.97 10.64,3.97 11.75,5.08 14.92,5.08 15.56,5.71 15.56,11.11 14.29,12.38 14.29,17.14 13.02,18.41 13.02,19.05 12.06,20 v11.75,20 | v45.09,23.81 40.64,23.81 40.01,23.18 38.73,23.18 38.1,23.81 29.84,23.81 26.04,20 23.81,20 23.18,19.37 v22.86,19.37
  Bottom 0.254: v45.09,23.81 IC2.11 | v22.86,19.37 20,19.37 19.3,20.07 IC1.30 12.63,20.07 12.56,20 v11.75,20
PA10/RXD1  (via drill 0.4)
  Top 0.254: X3.3 10.95,3.33 12.22,4.6 15.4,4.6 16.19,5.4 16.19,17.78 13.34,20.64 v13.34,21.27 | v42.55,25.08 41.91,24.45 40.32,24.45 39.69,23.81 39.05,23.81 38.42,24.45 29.53,24.45 25.72,20.64 v22.86,20.64
  Bottom 0.254: v13.34,21.27 14.04,20.57 IC1.31 22.23,20.57 22.23,20.64 v22.86,20.64 | v42.55,25.08 44.22,26.76 R4.1
PA11  (via drill 0.4)
  Top 0.254: X3.4 13.49,3.33 14.29,4.13 15.88,4.13 16.83,5.08 16.83,18.1 14.29,20.64 14.29,21.59 v13.34,22.54
  Bottom 0.254: v13.34,22.54 14.81,21.07 IC1.32
PA12  (via drill 0.4)
  Top 0.254: X3.5 16.03,3.33 17.46,4.76 17.46,18.41 14.92,20.95 14.92,22.23 v13.34,23.81
  Bottom 0.254: IC1.33 15.58,21.57 v13.34,23.81
PA13  (via drill 0.4)
  Top 0.254: X3.6 18.57,3.97 18.1,4.45 18.1,18.73 15.56,21.27 15.56,22.86 v14.61,23.81
  Bottom 0.254: v14.61,23.81 14.61,23.5 16.03,22.07 IC1.34
PA14  (via drill 0.4)
  Top 0.254: v18.41,27.3 18.73,26.99 18.73,8.57 20.32,6.99 v20.95,6.99
  Bottom 0.254: v20.95,6.99 21.11,6.83 X3.7 | IC1.37 18.84,26.88 v18.41,27.3
PA15  (via drill 0.4)
  Top 0.254: v20.32,26.99 20,26.67 20,15.24 20.64,14.61 20.64,10.16 22.86,7.94 v22.86,6.99
  Bottom 0.254: IC1.38 19.34,26.01 v20.32,26.99 | v22.86,6.99 23.65,6.2 X3.8
PB1  (via drill 0.4)
  Top 0.254: v23.5,17.46 23.5,18.73 24.13,19.37 26.35,19.37 30.16,23.18 37.15,23.18 v37.47,22.86 | X1.14 37.62,36.52 37.62,28.57 37.62,27.78 37.62,27.46 v37.47,27.3
  Bottom 0.254: IC1.22 19.84,17.14 20.16,17.46 v23.5,17.46 | v37.47,22.86 v37.47,27.3
RXD1X  (via drill 0.4)
  Top 0.254: v30.8,27.94 30,28.73 30,36.52 X1.11
  Bottom 0.254: IC2.13 47.62,27.62 46.99,28.26 37.15,28.26 35.56,26.67 34.61,26.67 33.97,27.3 31.43,27.3 v30.8,27.94
SCL  (via drill 0.4)
  Top 0.254: v22.23,28.26 22.54,27.94 26.99,27.94 28.57,26.35 39.05,26.35 42.7,30 42.7,35.24 43.97,36.51 X1.16
  Bottom 0.254: IC1.42 21.34,27.37 v22.23,28.26
SCLK  (via drill 0.4)
  Top 0.254: X1.5 16.03,36.51 DSP1.37 13.49,33.18 15.24,31.43 15.24,27.94 10.79,23.5 10.79,17.78 v11.75,16.83
  Bottom 0.254: IC1.26 17.31,18.1 15.56,18.1 14.29,16.83 v11.75,16.83
SDA  (via drill 0.4)
  Top 0.254: v22.54,26.99 22.86,27.3 26.67,27.3 28.26,25.72 39.37,25.72 45.24,31.59 45.24,35.24 46.51,36.51 X1.17
  Bottom 0.254: IC1.43 21.84,26.29 v22.54,26.99
TXD1X  (via drill 0.4)
  Top 0.254: v34.92,27.62 34.29,26.99 28.89,26.99 27.46,28.42 27.46,36.52 X1.10
  Bottom 0.254: v34.92,27.62 36.2,28.89 47.31,28.89 48.9,27.3 IC2.14
VBAT  (via drill 0.4)
  Top 0.305: v39.37,24.77 39.05,25.08 27.94,25.08 v27.62,24.77
  Bottom 0.254: IC1.1 26.88,23.07 27.62,23.81 v27.62,24.77
  Bottom 0.305: R6.2 40.55,11.02 40.96,11.43 40.96,14.61 40.64,14.92 40.64,20.95 39.37,22.23 v39.37,24.77 | R6.2 C20.2 | R6.2 40.01,8.89 44.13,4.76 45.4,4.76 46.51,3.65 X3.17

### Text on the board
Top: TOP | 140130 | CORDI1 R01 | UVC Ingenieure
Route2: L2 | L3
Bottom: BOT
bPlace: 1 | 10 | 20 | 1 | 10 | 20